# Altium schematic sheet 网络通信电路.SchDoc
size A4; SheetNumber: 7; SheetTotal: 7
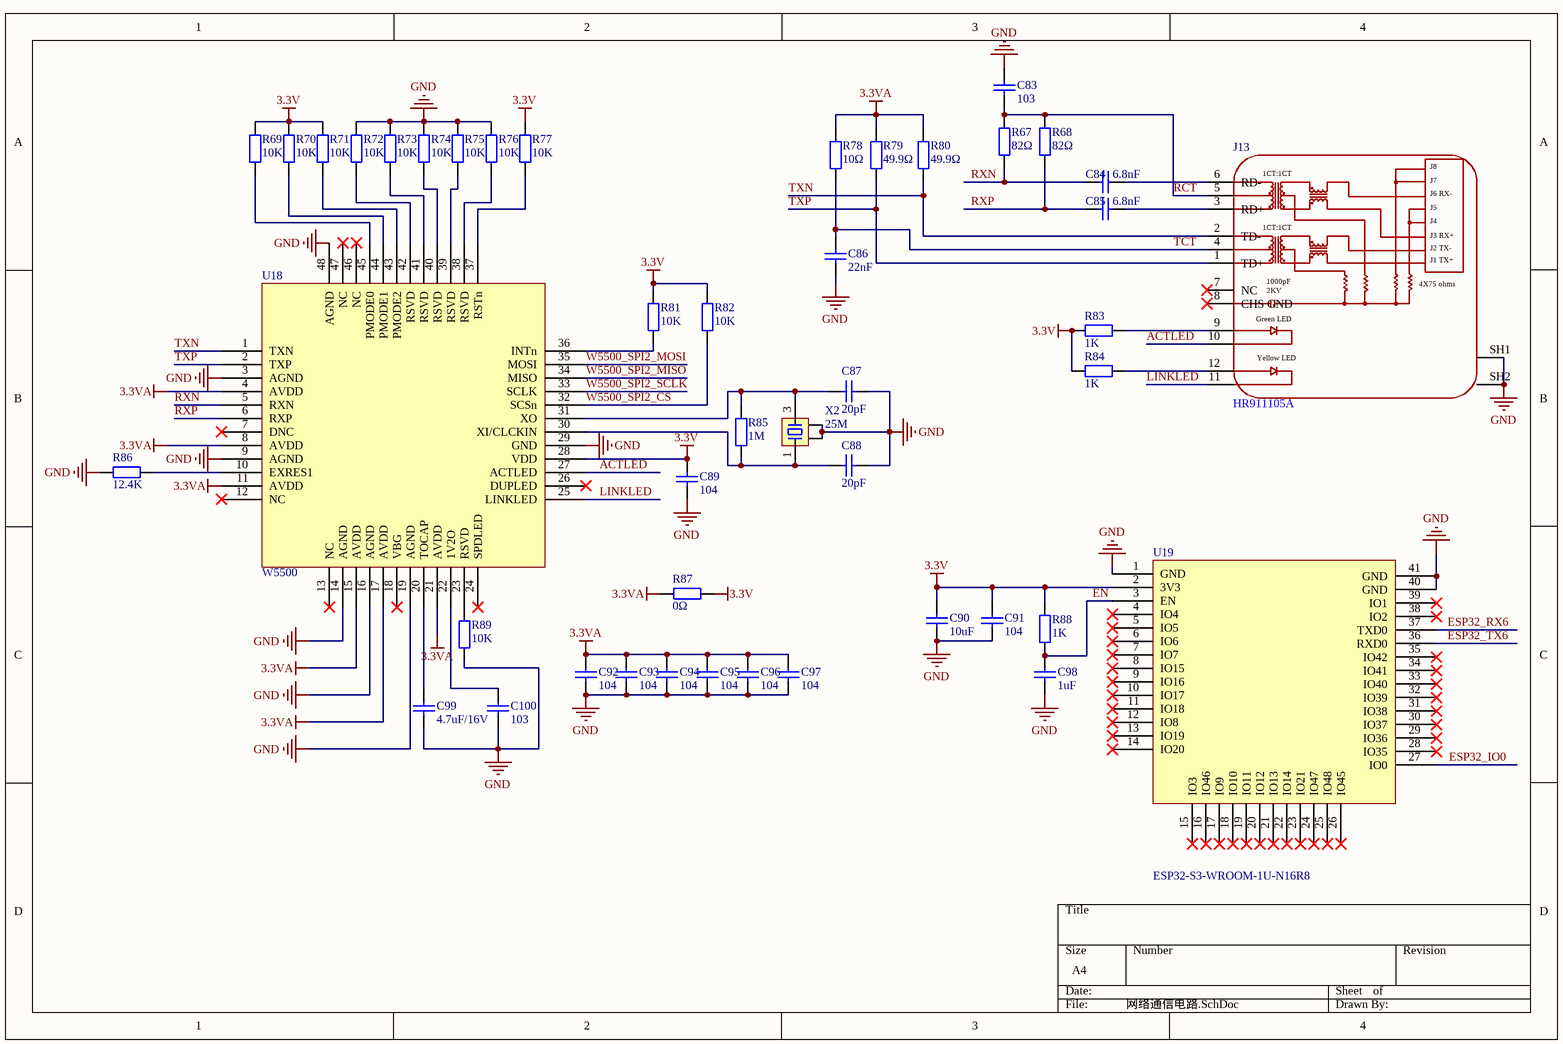
[diagram p0: 网络通信电路.SchDoc]

## Parts
C83  103  [C 0603_L]
C84  6.8nF  [C 0603_L]
C85  6.8nF  [C 0603_L]
C86  22nF  [C 0603_L]
C87  20pF  [C 0603_L]
C88  20pF  [C 0603_L]
C89  104  [C 0603_L]
C90  10uF  [C 0603_L]
C91  104  [C 0603_L]
C92  104  [C 0603_L]
C93  104  [C 0603_L]
C94  104  [C 0603_L]
C95  104  [C 0603_L]
C96  104  [C 0603_L]
C97  104  [C 0603_L]
C98  1uF  [C 0603_L]
C99  4.7uF/16V  [C 0603_L]
C100  103  [C 0603_L]
J13  HR911105A  [RJ45-TH_HR911105A]
R67  82Ω  [R 0603_L]
R68  82Ω  [R 0603_L]
R69  10K  [R 0603_L]
R70  10K  [R 0603_L]
R71  10K  [R 0603_L]
R72  10K  [R 0603_L]
R73  10K  [R 0603_L]
R74  10K  [R 0603_L]
R75  10K  [R 0603_L]
R76  10K  [R 0603_L]
R77  10K  [R 0603_L]
R78  10Ω  [R 0603_L]
R79  49.9Ω  [R 0603_L]
R80  49.9Ω  [R 0603_L]
R81  10K  [R 0603_L]
R82  10K  [R 0603_L]
R83  1K  [R 0603_L]
R84  1K  [R 0603_L]
R85  1M  [R 0603_L]
R86  12.4K  [R 0603_L]
R87  0Ω  [R 0603_L]
R88  1K  [R 0603_L]
R89  10K  [R 0603_L]
U18  W5500  [LQFP48 7X7_L]
U19  ESP32-S3-WROOM-1U-N16R8  [WIRELM-SMD_ESP32-S3-WROOM-1U]
X2  25M  [OSC 3225-4P]

## Nets
3.3V: C89.2 C90.2 C91.2 R69.2 R70.2 R71.2 R77.2 R81.2 R82.2 R83.2 R84.2 R87.2 R88.1 U18.28(VDD) U19.2(3V3)
3.3VA: C92.2 C93.2 C94.2 C95.2 C96.2 C97.2 R78.1 R79.1 R80.1 R87.1 U18.4(AVDD) U18.8(AVDD) U18.11(AVDD) U18.15(AVDD) U18.17(AVDD) U18.21(AVDD)
GND: C83.2 C86.2 C87.1 C88.1 C89.1 C90.1 C91.1 C92.1 C93.1 C94.1 C95.1 C96.1 C97.1 C98.1 C99.1 C100.1 J13.SH1 J13.SH2 R72.2 R73.2 R74.2 R75.2 R76.2 R86.1 R89.1 U18.3(AGND) U18.9(AGND) U18.14(AGND) U18.16(AGND) U18.19(AGND) U18.29(GND) U18.48(AGND) U19.1(GND) U19.40(GND) U19.41(GND) X2.2 X2.4
ACTLED: J13.10 U18.27(ACTLED)
EN: C98.2 R88.2 U19.3(EN)
ESP32_IO0: U19.27(IO0)
ESP32_RX6: U19.37(TXD0)
ESP32_TX6: U19.36(RXD0)
LINKLED: J13.11 U18.25(LINKLED)
RCT: C83.1 J13.5 R67.1 R68.1
RXN: C84.1 R67.2 U18.5(RXN)
RXP: C85.1 R68.2 U18.6(RXP)
TCT: C86.1 J13.4 R78.2
TXN: J13.2(TD-) R80.2 U18.1(TXN)
TXP: J13.1(TD+) R79.2 U18.2(TXP)
W5500_SPI2_CS: R82.1 U18.32(SCSn)
W5500_SPI2_MISO: U18.34(MISO)
W5500_SPI2_MOSI: U18.35(MOSI)
W5500_SPI2_SCLK: U18.33(SCLK)
NetC84_2: C84.2 J13.6(RD-)
NetC85_2: C85.2 J13.3(RD+)
NetC87_2: C87.2 R85.2 U18.31(XO) X2.3
NetC88_2: C88.2 R85.1 U18.30(XI/CLCKIN) X2.1
NetC99_2: C99.2 U18.20(TOCAP)
NetC100_2: C100.2 U18.22(1V2O)
NetJ13_9: J13.9 R83.1
NetJ13_12: J13.12 R84.1
NetR69_1: R69.1 U18.45(PMODE0)
NetR70_1: R70.1 U18.44(PMODE1)
NetR71_1: R71.1 U18.43(PMODE2)
NetR72_1: R72.1 U18.42(RSVD)
NetR73_1: R73.1 U18.41(RSVD)
NetR74_1: R74.1 U18.40(RSVD)
NetR75_1: R75.1 U18.39(RSVD)
NetR76_1: R76.1 U18.38(RSVD)
NetR77_1: R77.1 U18.37(RSTn)
NetR81_1: R81.1 U18.36(INTn)
NetR86_2: R86.2 U18.10(EXRES1)
NetR89_2: R89.2 U18.23(RSVD)

Not connected (* = marked no-connect by the designer): J13 7(NC)* 8(CHS_GND)*; U18 7(DNC)* 12(NC)* 13(NC)* 18(VBG)* 24(SPDLED)* 26(DUPLED)* 46(NC)* 47(NC)*; U19 4(IO4)* 5(IO5)* 6(IO6)* 7(IO7)* 8(IO15)* 9(IO16)* 10(IO17)* 11(IO18)* 12(IO8)* 13(IO19)* 14(IO20)* 15(IO3)* 16(IO46)* 17(IO9)* 18(IO10)* 19(IO11)* 20(IO12)* 21(IO13)* 22(IO14)* 23(IO21)* 24(IO47)* 25(IO48)* 26(IO45)* 28(IO35)* 29(IO36)* 30(IO37)* 31(IO38)* 32(IO39)* 33(IO40)* 34(IO41)* 35(IO42)* 38(IO2)* 39(IO1)*

## Notes on the sheet
- (in symbol HR911105A_C12074) J8; 1CT:1CT; J7; J6 RX-; J5; J4; J3 RX+; J2 TX-; J1 TX+; 1000pF; 4X75 ohms; 2KV; Green LED; Yellow LED

## Library data of the parts
C83-C100 = Cap: 0603贴片电容; Published: 8-Jun-2000; LatestRevisionDate: 17-Jul-2002; LatestRevisionNote: Re-released for DXP Platform.; PackageReference: RAD-0.3; Publisher: Altium Limited; PackageDescription: Radial Cap, Thru-Hole; 2 Leads; 0.3 in Pin Spacing
J13 = HR911105A_C12074: 网口; Manufacturer: HANRUN(汉仁); Add into BOM: yes; Connector Type: RJ45插座; Number of Ports: 1; LED: 带LED; PoE: 不带PoE; Supplementary Features: 带滤波; Symbol: HR911105A_C12074; Device: HR911105A_C12074; LCSC Part Name: 带LED; Supplier Part: C12074; Manufacturer Part: HR911105A; Supplier Footprint: 插件; JLCPCB Part Class: 扩展库; Datasheet: https://item.szlcsc.com/datasheet/HR911105A/12651.html; Supplier: LCSC; Convert to PCB: yes; Mounting Type: -; Shielding: -; Ratings: -; Contact Material: -; Contact Plating: -; Operating Temperature: -
R67-R89 = Res: C0603贴片电阻; BOM名称: 贴片电阻; 版权归属: 源创客; 学习资源: www.ooocke.com
U18 = W5500: W5500以太网芯片
U19 = ESP32-S3-WROOM-1U-N16R8: Manufacturer: ESPRESSIF(乐鑫); Add into BOM: yes; Symbol: ESP32-S3-WROOM-1U-N16R8; Device: ESP32-S3-WROOM-1U-N16R8; LCSC Part Name: ESP32-S3-WROOM-1U-N16R8; Supplier Part: C3013946; Manufacturer Part: ESP32-S3-WROOM-1U-N16R8; Supplier Footprint: SMD,19.2x18mm; JLCPCB Part Class: 扩展库; Datasheet: https://item.szlcsc.com/datasheet/ESP32-S3-WROOM-1U-N16R8/3522416.html; Supplier: LCSC; Convert to PCB: yes
X2 = XTAL-4P: 4脚无源晶振; 版权归属: 封装库来自淘宝卖家 ID：黄晶宝石; BOM名称: 4脚无源晶振; 学习资源: https://shop463601444.taobao.com